# EAGLE schematic full (EAGLE 9.5.2)
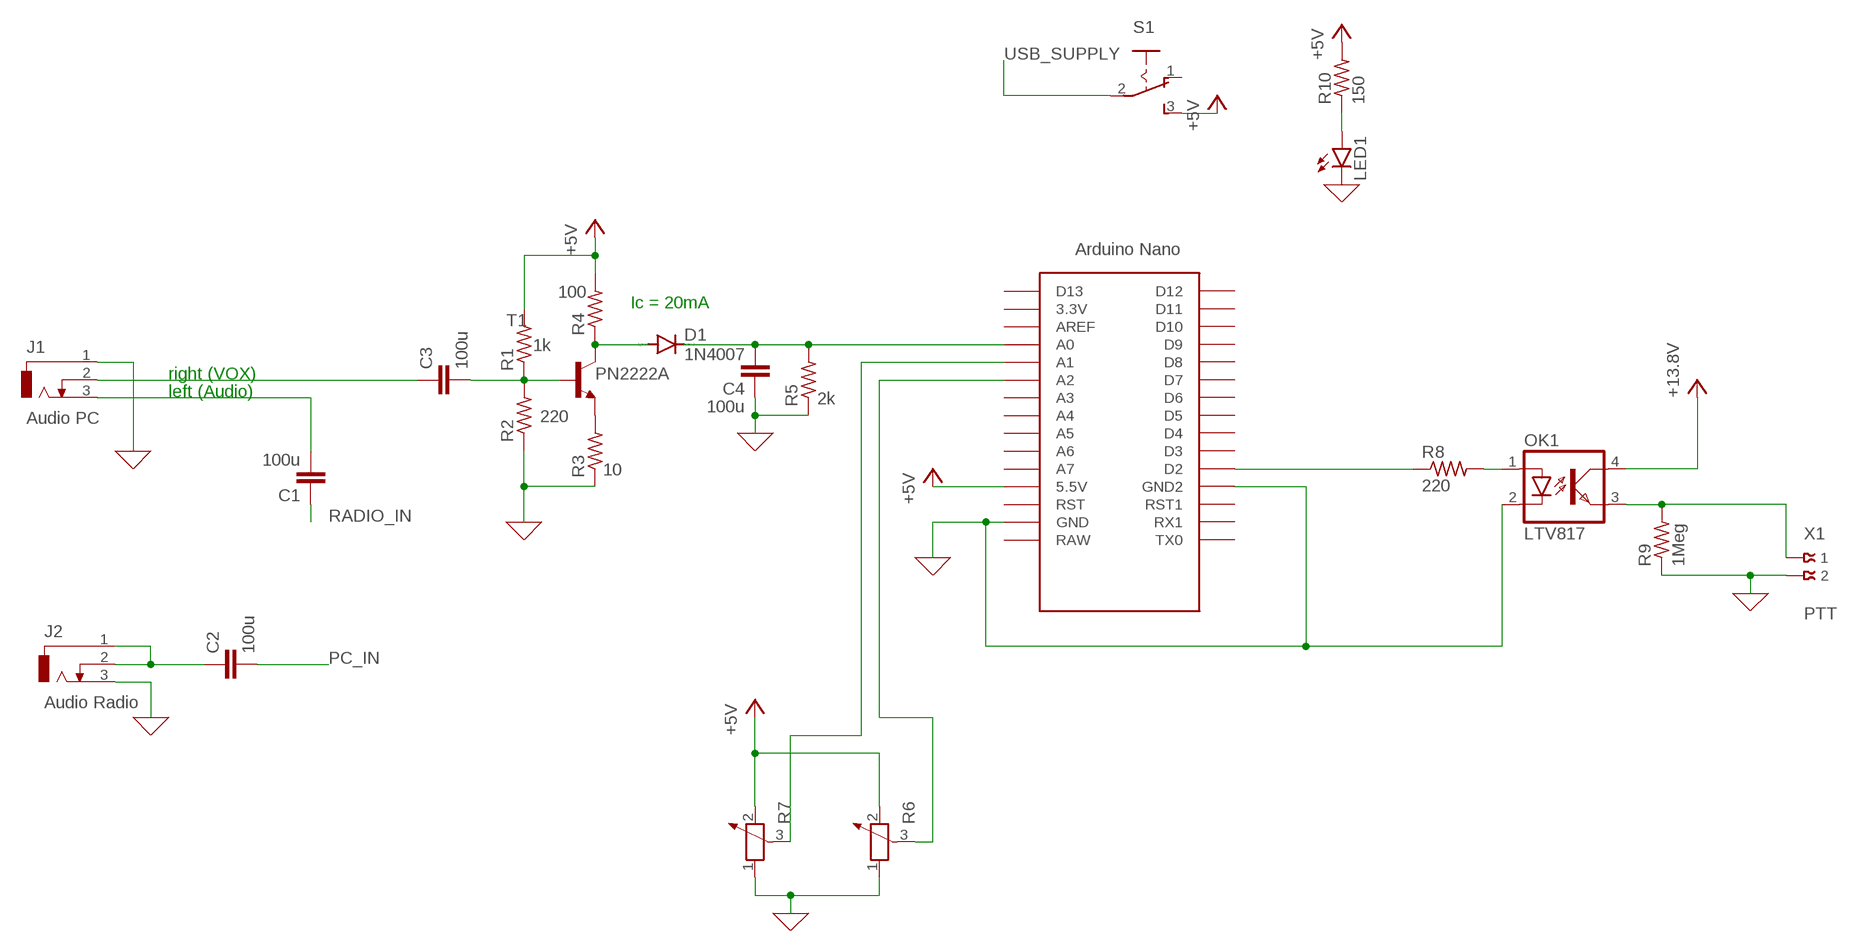
[diagram p0: schematic, sheet 1]

## Parts
C1  100u  C-EU025-024X044  [C025-024X044]
C2  100u  C-EU025-024X044  [C025-024X044]
C3  100u  C-EU025-024X044  [C025-024X044]
C4  100u  C-EU025-024X044  [C025-024X044]
D1  1N4007  1N4004  [DO41-10]
J1  Audio PC  DCJ0202  [DCJ0202]
J2  Audio Radio  DCJ0202  [DCJ0202]
LED1  LAP4-TOP  [P47F-TOP]
OK1  LTV817  SFH618A-2  [DIP4]
R1  1k  R-US_0204/2V  [0204V]
R2  220  R-US_0204/2V  [0204V]
R3  10  R-US_0204/2V  [0204V]
R4  100  R-US_0204/2V  [0204V]
R5  2k  R-US_0204/2V  [0204V]
R6  POTENTIOMETER_PT-10S  [PT-10S]
R7  POTENTIOMETER_PT-10S  [PT-10S]
R8  220  R-US_0204/2V  [0204V]
R9  1Meg  R-US_0204/2V  [0204V]
R10  150  R-US_0204/2V  [0204V]
S1  255SB  [255SB]
T1  PN2222A  2N3440  [TO5]
U$1  NANO  [NANO]
X1  PTT  009176002  [009176002]

## Nets
0: C4.1 J1.1 J2.3 LED1.C OK1.2(C) R2.1 R3.1 R5.1 R6.1 R7.1 R9.1 U$1.GND U$1.GND1(GND2) X1.2 ; supply symbol labelled GND
+5V: R1.2 R4.2 R6.2 R7.2 R10.2 S1.3(S) U$1.5V(5.5V)
N$1: C3.1 J1.2
N$2: C1.2 J1.3
N$3: C2.1 J2.1 J2.2
N$4: C3.2 R1.1 R2.2 T1.2(B)
N$5: R3.2 T1.1(E)
N$6: D1.A R4.1 T1.3(C)
N$7: C4.2 D1.C R5.2 U$1.A0
N$8: R8.1 U$1.D2
N$9: OK1.1(A) R8.2
N$10: R6.3 U$1.A2
N$11: R7.3 U$1.A1
N$12: OK1.3(EMIT) R9.2 X1.1
N$13: LED1.A R10.1
PC_IN: C2.2
RADIO_IN: C1.1
USB_SUPPLY: S1.2(P)
VCC: OK1.4(COL) ; supply symbol labelled +13.8V
Unconnected: S1.1(O) U$1.3.3V U$1.A3 U$1.A4 U$1.A5 U$1.A6 U$1.A7 U$1.AREF U$1.D3 U$1.D4 U$1.D5 U$1.D6 U$1.D7 U$1.D8 U$1.D9 U$1.D10 U$1.D11 U$1.D12 U$1.D13 U$1.ICSP1 U$1.ICSP2 U$1.ICSP3 U$1.ICSP4 U$1.ICSP5 U$1.ICSP6 U$1.RAW U$1.RST U$1.RST1 U$1.RX1 U$1.TX0

## Notes on the sheet
- Ic = 20mA
- right (VOX)
- left (Audio)

## Library data of the parts
C1-C4 = rcl:C-EU: CAPACITOR, European symbol; SPICEPREFIX: C
D1 = diode:1N4004: DIODE general purpose rectifier, 1 A
J1 J2 = con-jack:DCJ0202: DC POWER JACK Source: DCJ0202.pdf; OC_FARNELL: unknown; OC_NEWARK: unknown
LED1 = led:*P4: PointLED® Enhanced Thinfilm LED TOP & BOTTOM mount LS P47F, LR P47F, LA P47F, LY P47F, LT P4SG, LB P4SG, LW P4SG Source: http://catalog.osram-os.com .. LA_LR_LS_LY_P47F_Pb_free.pdf
OK1 = optocoupler:SFH618?*: Optocoupler, Phototransistor Output, Low Input Current Source: Data sheet <http://www.vishay.com/docs/83673/sfh618.pdf>; MF: VISHAY/TELEFUNKEN; MPN: SFH618A-2; OC_FARNELL: 6424855; OC_NEWARK: 21H7744
R1-R5 R8-R10 = rcl:R-US_: RESISTOR, American symbol; SPICEPREFIX: R
R6 R7 = rcl:POTENTIOMETER_: Potentiometer; SPICEMODEL: POT; SPICEPREFIX: X
S1 = switch:255SB: SLIDING SWITCH Distributor Buerklin, 11G810
T1 = transistor:2N3440: NPN TRANSISTOR
U$1 = Arduino-clone:NANO: Arduino Nano
X1 = con-avx:00917?002: Wire to Board Strip IDC Connector 2 WAY Source: http://www.avx.com/docs/Catalogs/9176.pdf http://www.avx.com/docs/Catalogs/9177.pdf; MPN: 009176002001006; OC_FARNELL: 1582834; OC_NEWARK: 66M1960